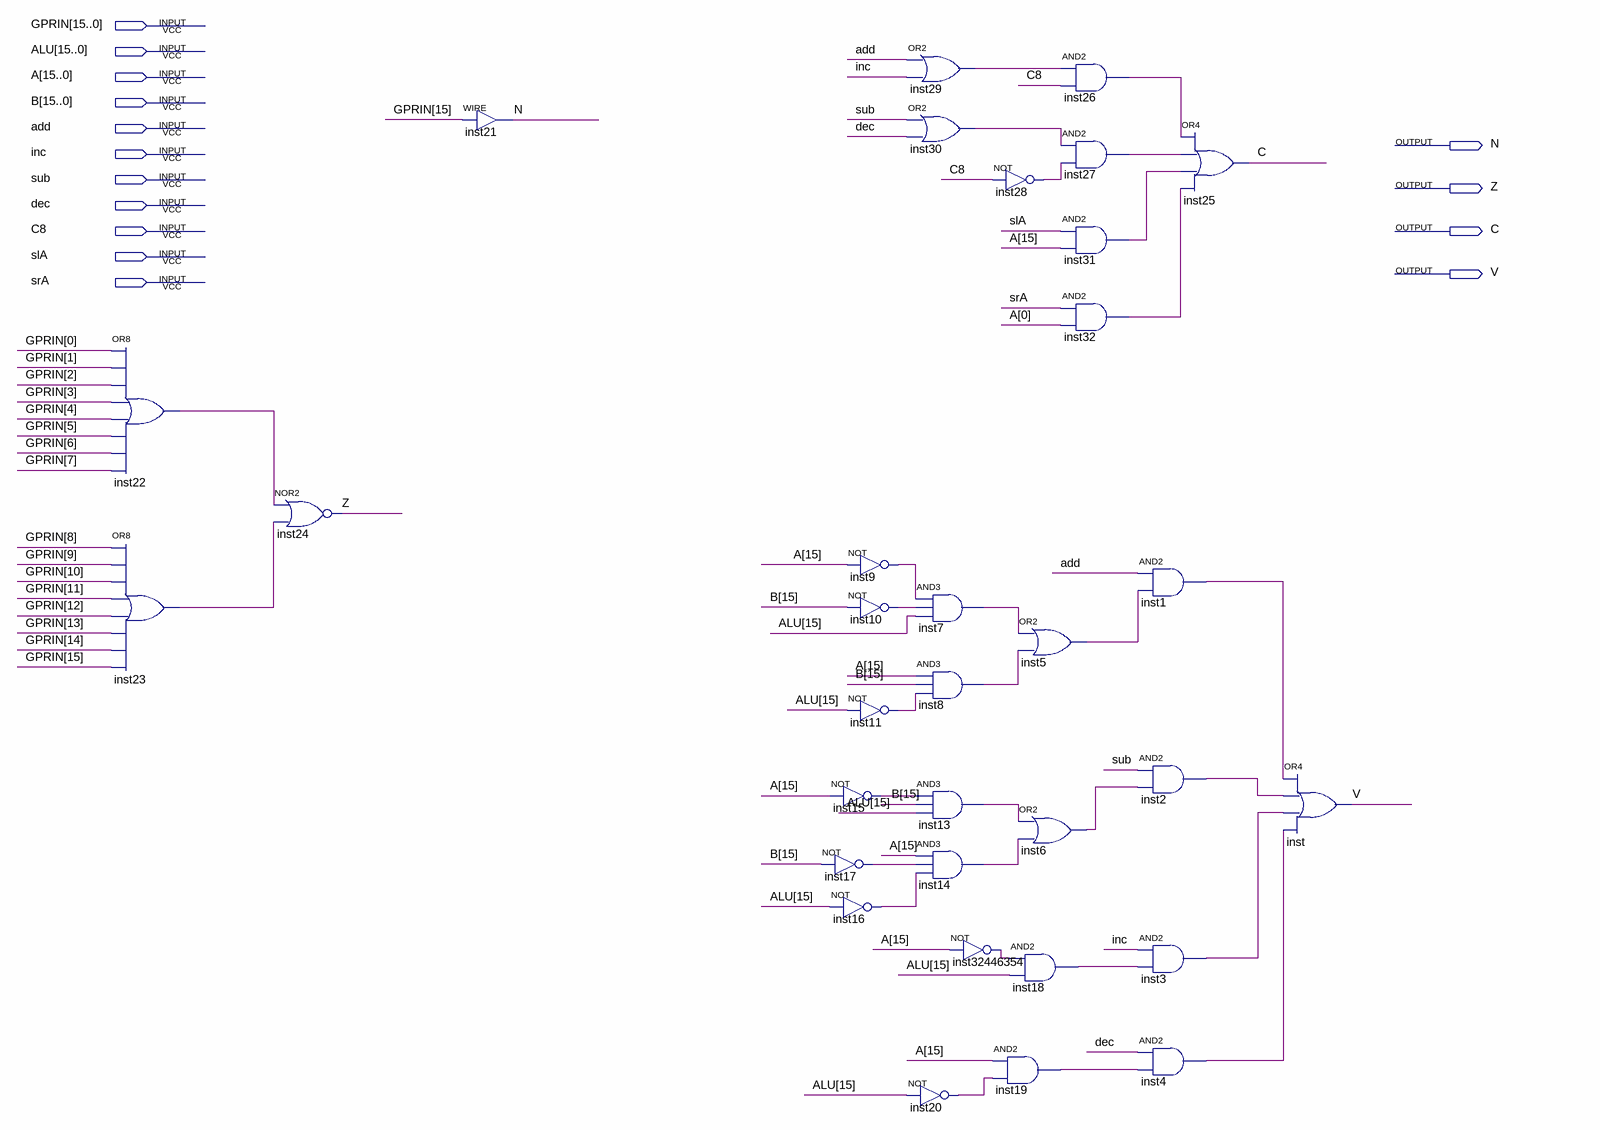
[diagram p0: schematic sheet]
// Quartus schematic PSW_init.bdf as structural Verilog: 33 symbols, 15 pins
module PSW_init (
  input  [15:0] GPRIN,
  input  [15:0] ALU,
  input  [15:0] A,
  input  [15:0] B,
  input  add,
  input  inc,
  input  sub,
  input  dec,
  input  C8,
  input  slA,
  input  srA,
  output N,
  output Z,
  output C,
  output V
);

  wire inst1_out, inst2_out, inst3_out, inst4_out, inst5_out, inst6_out, inst7_out, inst8_out, inst9_out,
       inst10_out, inst11_out, inst13_out, inst14_out, inst15_out, inst16_out, inst17_out, inst18_out,
       inst19_out, inst20_out, inst22_out, inst23_out, inst26_out, inst27_out, inst28_out, inst29_out,
       inst30_out, inst31_out, inst32_out, inst32446354_out;

  or inst22 (inst22_out, GPRIN[0], GPRIN[1], GPRIN[2], GPRIN[3], GPRIN[4], GPRIN[5], GPRIN[6], GPRIN[7]);
  or inst23 (inst23_out, GPRIN[8], GPRIN[9], GPRIN[10], GPRIN[11], GPRIN[12], GPRIN[13], GPRIN[14], GPRIN[15]);
  nor inst24 (Z, inst22_out, inst23_out);
  assign N = GPRIN[15];  // WIRE inst21
  not inst9 (inst9_out, A[15]);
  not inst10 (inst10_out, B[15]);
  not inst11 (inst11_out, ALU[15]);
  not inst15 (inst15_out, A[15]);
  not inst17 (inst17_out, B[15]);
  not inst16 (inst16_out, ALU[15]);
  or inst29 (inst29_out, add, inc);
  or inst30 (inst30_out, sub, dec);
  and inst7 (inst7_out, inst9_out, inst10_out, ALU[15]);
  and inst8 (inst8_out, A[15], B[15], inst11_out);
  and inst13 (inst13_out, inst15_out, B[15], ALU[15]);
  and inst14 (inst14_out, A[15], inst17_out, inst16_out);
  not inst20 (inst20_out, ALU[15]);
  not inst28 (inst28_out, C8);
  not inst32446354 (inst32446354_out, A[15]);
  and inst18 (inst18_out, inst32446354_out, ALU[15]);
  and inst19 (inst19_out, A[15], inst20_out);
  and inst26 (inst26_out, inst29_out, C8);
  and inst27 (inst27_out, inst30_out, inst28_out);
  and inst31 (inst31_out, slA, A[15]);
  and inst32 (inst32_out, srA, A[0]);
  or inst5 (inst5_out, inst7_out, inst8_out);
  or inst6 (inst6_out, inst13_out, inst14_out);
  and inst1 (inst1_out, add, inst5_out);
  and inst2 (inst2_out, sub, inst6_out);
  and inst3 (inst3_out, inc, inst18_out);
  and inst4 (inst4_out, dec, inst19_out);
  or inst25 (C, inst26_out, inst27_out, inst31_out, inst32_out);
  or inst (V, inst1_out, inst2_out, inst3_out, inst4_out);
endmodule
